# Altium schematic sheet ToFBoard.SchDoc
size A4; Organization: Altium Limited; Address1: L3, 12a Rodborough Rd; Address2: Frenchs Forest; Address3: NSW; Address4: Australia 2086
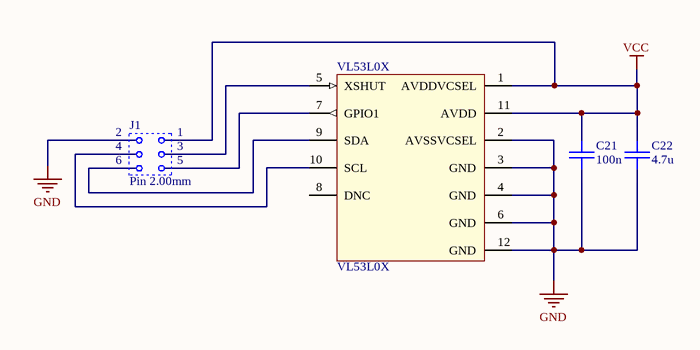
[diagram p0: ToFBoard.SchDoc]

## Parts
C21  100n  [0805]
C22  4.7u  [0805]
J1  Pin 2.00mm  [Goldpin 2.00mm pin 2X3]
VL53L0X  VL53L0X

## Nets
GND: C21.2 C22.2 J1.2 VL53L0X.2(AVSSVCSEL) VL53L0X.3(GND) VL53L0X.4(GND) VL53L0X.6(GND) VL53L0X.12(GND)
VCC: C21.1 C22.1 J1.1 VL53L0X.1(AVDDVCSEL) VL53L0X.11(AVDD)
NetJ1_3: J1.3 VL53L0X.5(XSHUT)
NetJ1_4: J1.4 VL53L0X.10(SCL)
NetJ1_5: J1.5 VL53L0X.7(GPIO1)
NetJ1_6: J1.6 VL53L0X.9(SDA)

Not connected (* = marked no-connect by the designer): VL53L0X 8(DNC)

## Notes on the sheet
- Title
- Size:
- Date:
- A4
- Number:
- Time:
- Revision:
- Sheet
- of
- File:

## Library data of the parts
C21 C22 = C_CER: Ceramic Capacitor
J1 = Goldpin 2.00 pin 2x3: Symbol: NINIGI ZL303-2X10P; Supplier: TME; URL: http://www.tme.eu/pl/details/zl303-2x10p/listwy-i-gniazda-kolkowe/ninigi/#
VL53L0X = VL53L0X ToF: Time-of-Flight ranging and gesture detection sensor; Supplier: Farnell; URL: http://pl.farnell.com/stmicroelectronics/vl53l0cxv0dh-1/gesture-detection-sensor-digital/dp/2762754?st=VL53L0X